# EAGLE design PCBEndCap (EAGLE 8.3.1)
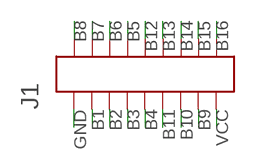
[diagram p0: schematic, sheet 1]

## Parts
J1  CONNECTORJST2X9_2MM  [CONNECTOR9X2_2MMPITCH]

## Nets
B1: J1.P$2
B2: J1.P$3
B3: J1.P$4
B4: J1.P$5
B5: J1.P$15
B6: J1.P$16
B7: J1.P$17
B8: J1.P$18
B9: J1.P$8
B10: J1.P$7
B11: J1.P$6
B12: J1.P$14
B13: J1.P$13
B14: J1.P$12
B15: J1.P$11
B16: J1.P$10
GND: J1.P$1
VCC: J1.P$9

## Library data of the parts
J1 = MarkIIEaglelbr:CONNECTORJST2X9_2MM

## Board
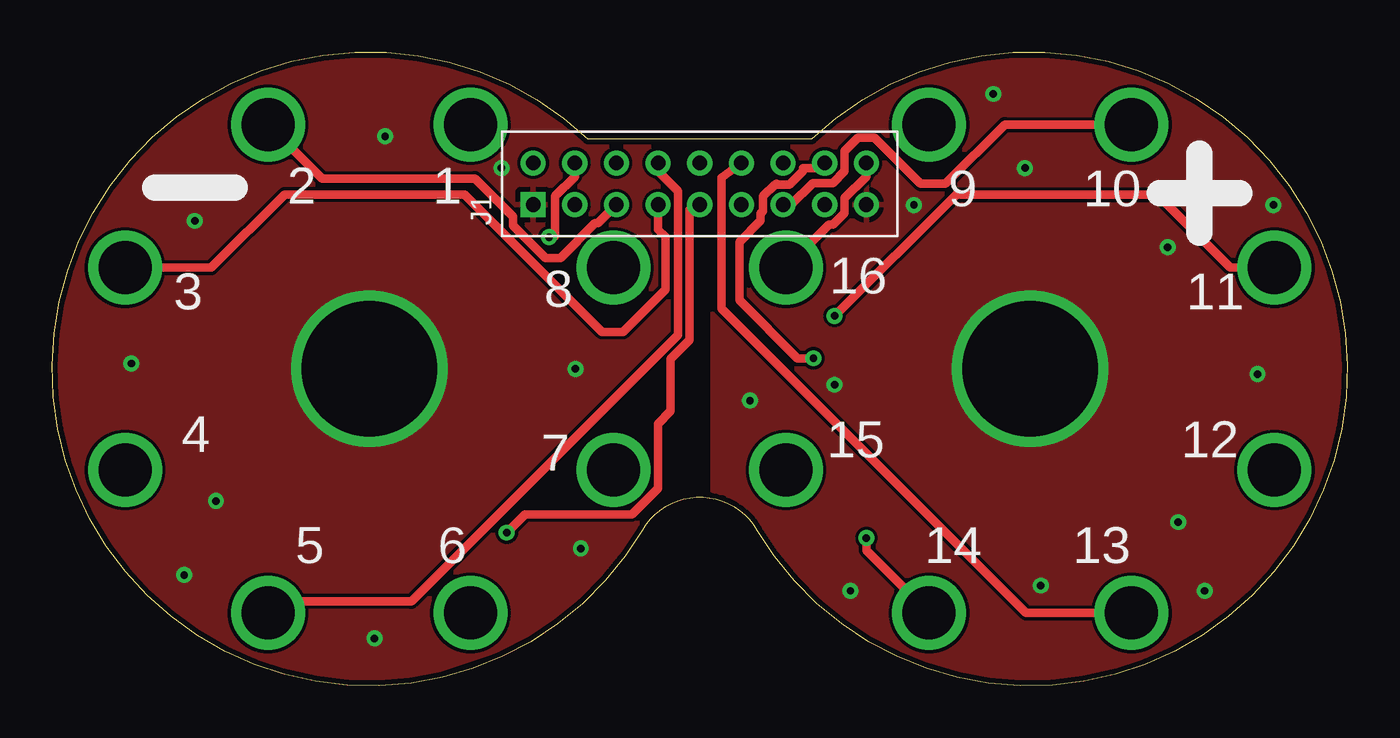
[diagram p1: board, top side]
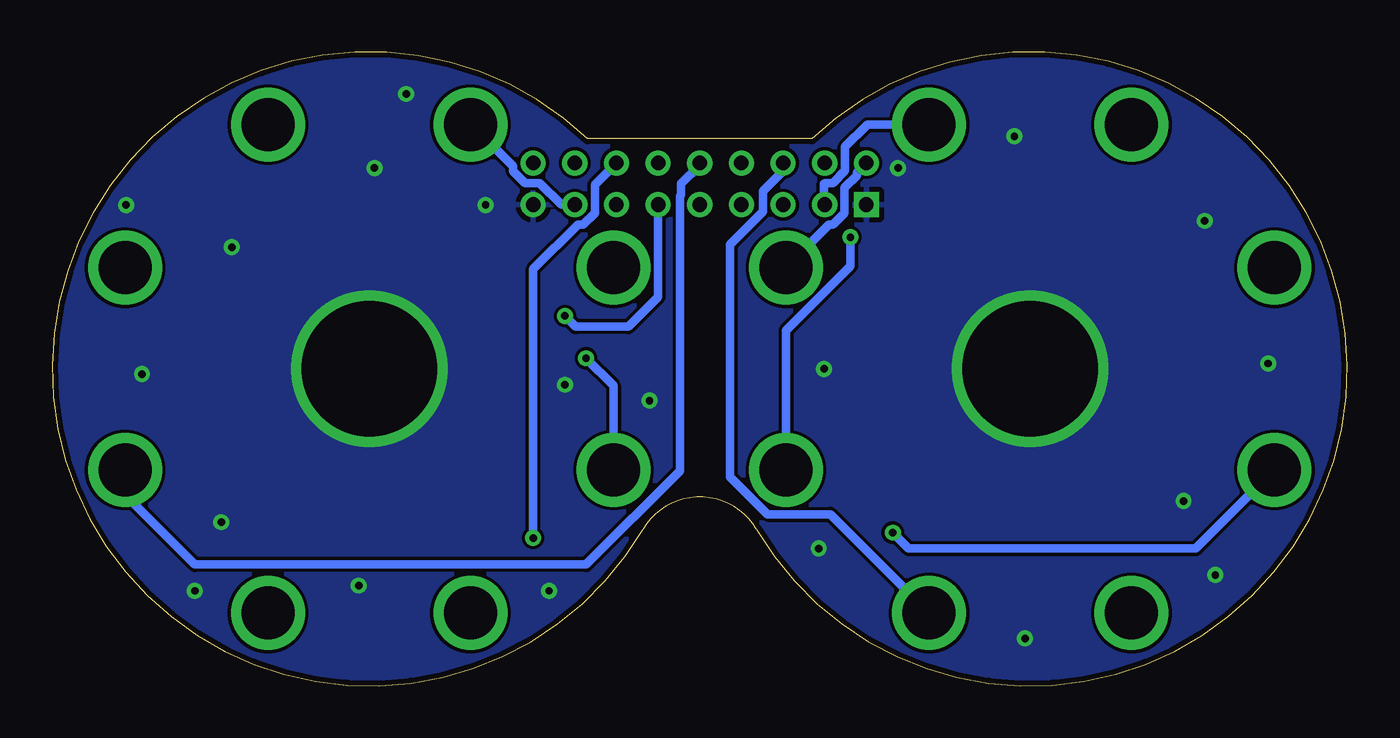
[diagram p2: board, bottom side, seen from below]

Size 62.23 x 30.46 mm. Coordinates in mm from the lower left corner, seen from the top.
Outline: 28.38,7.51 arc-283 25.74,26.28 36.49,26.28 arc-283 33.85,7.51 arc119 28.38,7.51
Copper layers (1*16): Top 0.035mm / dielectric 1.5mm / Bottom 0.035mm
Design rules "default *": minimum track width 6mil, minimum drill 0.35mm, track to track 6mil, track to pad 6mil, pad to pad 6mil, via to via 6mil, smd to smd 6mil, copper to edge 10mil, drill to drill 6mil, minimum pad ring 10mil, minimum via ring 8mil, stop-mask expansion 4mil, vias tented up to drill 0mil, thermal gap 10mil

### Footprints (pad centres in the part's own frame; a part is rotated, then mirrored left to right if it is on the bottom)
CONNECTOR9X2_2MMPITCH = drill 0.7 square: P$1 -8,-1 | drill 0.7: P$2 -6,-1; P$3 -4,-1; P$4 -2,-1; P$5 0,-1; P$6 2,-1; P$7 4,-1; P$8 6,-1; P$9 8,-1; P$10 8,1; P$11 6,1; P$12 4,1; P$13 2,1; P$14 0,1; P$15 -2,1; P$16 -4,1; P$17 -6,1; P$18 -8,1

### Placement (x,y rotation side)
J1  31.11,24.12 0 top

### Tracks (layer width: path | path; a pad name or v marks a point on that pad's centre or on a via)
B1  (via drill 2.54)
  Bottom 0.406: J1.P$2 25.14,23.15 25.14,24.12 25.1,24.16 24.72,24.16 24.13,24.75 24.13,25.9 23.06,26.96 v20.1,26.96
B2  (via drill 2.54)
  Top 0.406: v10.38,26.96 12.97,24.38 20.32,24.38 22.15,22.54 22.15,22.12 23.7,20.57 24.43,20.57 26.09,22.23 26.22,22.23 J1.P$3
B3  (via drill 2.54)
  Top 0.406: v3.51,20.09 7.65,20.09 11.17,23.61 19.81,23.61 26.41,17.01 27.43,17.01 29.46,19.04 29.46,21.58 29.11,21.93 J1.P$4 29.11,23.27
B4  (via drill 0.36, 2.54)
  Top 0.406: v21.84,7.36 22.72,8.24 27.86,8.24 29.11,9.49 29.11,12.59 29.72,13.2 29.72,15.71 30.63,16.63 30.63,22.89 J1.P$5
  Bottom 0.406: v21.84,7.36 21.08,6.6 7.28,6.6 v3.51,10.37
B5  (via drill 2.54)
  Top 0.406: J1.P$15 29.11,24.73 30.07,23.77 30.07,16.86 17.27,4.06 10.94,4.06 v10.38,3.5
B6  (via drill 2.54)
  Bottom 0.406: v20.1,3.5 24.84,8.24 27.86,8.24 29.66,10.05 29.66,21.21 28.07,22.8 28.07,23.77 27.11,24.73 J1.P$16
B7  (via drill 0.36, 2.54)
  Top 0.406: J1.P$17 25.11,24.48 24.15,23.52 24.15,21.61 24.13,21.58 v23.87,21.56
  Bottom 0.406: v26.97,10.37 26.97,17.08 23.87,20.17 v23.87,21.56
B8  (via drill 2.54)
  Bottom 0.406: 23.11,25.09 J1.P$18 23.57,24.67 23.57,24.52 24.15,23.93 24.15,22.73 24.72,22.16 24.9,22.16 v26.97,20.09
B9  (via drill 2.54)
  Bottom 0.406: v42.13,26.97 42.06,26.97 40.07,24.98 40.07,24.73 39.51,24.16 38.8,24.16 37.76,23.12 J1.P$8
B10  (via drill 2.54)
  Top 0.406: v51.85,26.97 45.77,26.97 42.92,24.12 41.72,24.12 39.51,26.34 38.72,26.34 38.07,25.69 38.07,24.73 37.51,24.16 36.54,24.16 35.5,23.12 J1.P$7
B11  (via drill 0.36, 2.54)
  Top 0.406: v37.59,17.77 43.43,23.61 53.08,23.61 56.61,20.09 v58.72,20.09
  Bottom 0.406: J1.P$6 33.11,18.69 34.54,17.26 37.08,17.26 v37.59,17.77
B12  (via drill 2.54)
  Bottom 0.406: v58.72,10.37 58.72,9.19 55.37,5.83 36.57,5.83 32.07,10.34 32.07,23.52 32,23.59 32,24.12 31.11,25.01 J1.P$14
B13  (via drill 2.54)
  Top 0.406: J1.P$13 32.15,24.42 32.15,18.13 46.78,3.5 v51.85,3.5
B14  (via drill 0.36, 2.54)
  Top 0.406: v42.13,3.5 39.11,6.51 v39.11,7.1
  Bottom 0.406: v39.11,7.1 39.11,20.02 36.97,22.16 36.72,22.16 36.15,22.73 36.15,24.08 J1.P$12
B15  (via drill 0.36, 2.54)
  Top 0.406: v36.57,15.74 35.81,15.74 33.02,18.53 33.02,21.33 34.03,22.34 34.03,22.69 34.15,22.81 34.15,23.52 34.72,24.08 34.76,24.08 | 34.76,24.08 34.8,24.12 | 34.76,24.08 35.43,24.08 36.07,24.73 36.07,24.88 36.88,24.88 J1.P$11
  Bottom 0.406: v36.57,15.74 35.26,14.42 v35.26,10.37
B16  (via drill 2.54)
  Top 0.406: v35.26,20.09 37.33,22.16 37.51,22.16 38.07,22.73 38.07,23.44 39.11,24.48 J1.P$10
GND  (via drill 0.36, 6.5)
  other vias: 15.24,15.23 3.81,15.49 25.14,15.23 21.59,24.88 16,26.41 15.49,2.28 25.4,6.6 6.35,5.33 6.86,22.34 7.87,8.88
  pour Top: 15.24,-0.33 arc-90 -0.64,15.55 arc-90 15.24,31.42 25.4,28.69 30.48,27.93 30.48,8.88 25.4,3.04
  pour Bottom: 15.24,-0.33 arc-90 -0.64,15.55 arc-90 15.24,31.42 30.48,27.61 30.48,8.88 26.67,4.75 26.67,4.56 24.38,2.28 17.78,-0.33
VCC  (via drill 0.36, 6.5)
  other vias: 46.99,15.23 33.53,13.71 37.59,14.47 41.4,23.11 46.73,24.88 45.21,28.44 53.59,21.07 58.67,23.11 57.91,14.98 55.37,4.56 54.1,7.87 47.5,4.82 38.35,4.56
  pour Bottom: 46.99,31.42 arc-90 62.86,15.55 arc-90 46.99,-3.12 31.75,6.02 31.75,27.68 32.26,27.93 44.45,31.42
  pour Top: 46.99,31.42 arc-90 62.86,15.55 arc-90 46.99,-3.12 31.75,6.02 31.75,27.68 44.45,31.42

### Text on the board
tPlace: 2 | 1 | 9 | 10 | 16 | 3 | 8 | 11 | 4 | 15 | 12 | 7 | 5 | 6 | 14 | 13